# EAGLE schematic power_board (EAGLE 8.2.0)
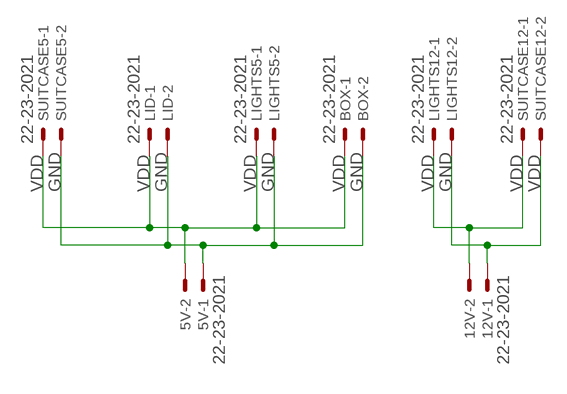
[diagram p0: schematic, sheet 1]

## Parts
5V  22-23-2021  [22-23-2021]
12V  22-23-2021  [22-23-2021]
BOX  22-23-2021  [22-23-2021]
LID  22-23-2021  [22-23-2021]
LIGHTS5  22-23-2021  [22-23-2021]
LIGHTS12  22-23-2021  [22-23-2021]
SUITCASE5  22-23-2021  [22-23-2021]
SUITCASE12  22-23-2021  [22-23-2021]

## Nets
GND: 5V.1 12V.1 BOX.2 LID.2 LIGHTS5.2 LIGHTS12.2 SUITCASE5.2 SUITCASE12.2
VDD: 5V.2 12V.2 BOX.1 LID.1 LIGHTS5.1 LIGHTS12.1 SUITCASE5.1 SUITCASE12.1

## Library data of the parts
5V 12V BOX LID LIGHTS5 LIGHTS12 SUITCASE5 SUITCASE12 = con-molex:22-23-2021: .100" (2.54mm) Center Header - 2 Pin; MF: MOLEX; MPN: 22-23-2021; OC_FARNELL: 1462926; OC_NEWARK: 25C3832